# Altium schematic sheet Power managment.SchDoc
size A4; Organization: Altium Limited; Address1: L3, 12a Rodborough Rd; Address2: Frenchs Forest; Address3: NSW; Address4: Australia 2086
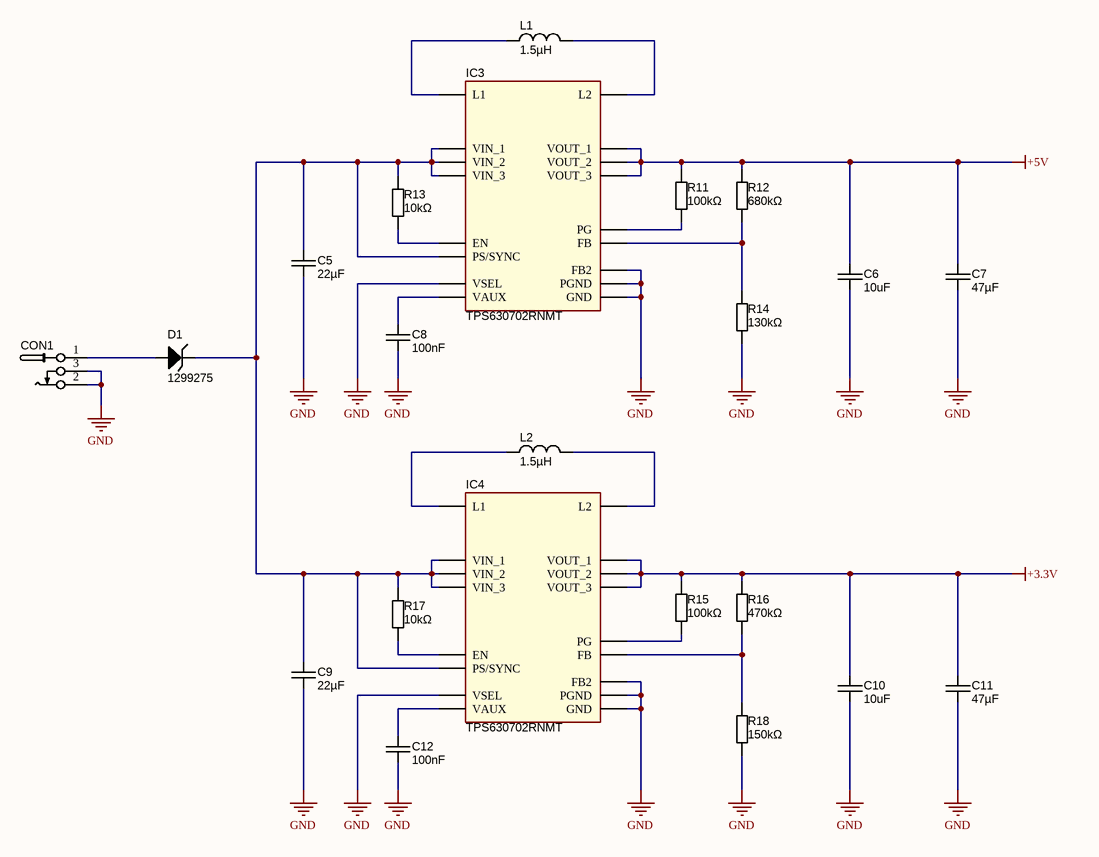
[diagram p0: Power managment.SchDoc]

## Parts
C5  value 22µF  [CAPC3216N]  (hidden comment: approved sub OK)
C6  value 10uF  [CAPC1608N]  (hidden comment: approved sub OK)
C7  value 47µF  [CAPC3216N]  (hidden comment: approved sub OK)
C8  value 100nF  [CAPC1608N]  (hidden comment: approved sub OK)
C9  value 22µF  [CAPC3216N]  (hidden comment: approved sub OK)
C10  value 10uF  [CAPC1608N]  (hidden comment: approved sub OK)
C11  value 47µF  [CAPC3216N]  (hidden comment: approved sub OK)
C12  value 100nF  [CAPC1608N]  (hidden comment: approved sub OK)
CON1  12V  [FC68148S_2]  (value not drawn)
D1  Supplier Part Number 1: 1299275  [DO-214AC_Unidirectional]  (hidden comment: Unidirectional, 400 W, 100 VDC)
IC3  TPS630702RNMT  [TPS630702RNMT]
IC4  TPS630702RNMT  [TPS630702RNMT]
L1  1.5µH  [INDPM6965X300N]
L2  1.5µH  [INDPM6965X300N]
R11  value 100kΩ  [RESC1608N]  (hidden comment: Thick Film)
R12  value 680kΩ  [RESC1608N]  (hidden comment: Thick Film)
R13  value 10kΩ  [RESC1608N]  (hidden comment: Thick Film)
R14  value 130kΩ  [RESC1608N]  (hidden comment: Thick Film)
R15  value 100kΩ  [RESC1608N]  (hidden comment: Thick Film)
R16  value 470kΩ  [RESC1608N]  (hidden comment: Thick Film)
R17  value 10kΩ  [RESC1608N]  (hidden comment: Thick Film)
R18  value 150kΩ  [RESC1608N]  (hidden comment: Thick Film)

## Nets
+3.3V: C10.2 C11.1 IC4.7(VOUT_1) IC4.8(VOUT_2) IC4.A7(VOUT_3) R15.2 R16.2
+5V: C6.2 C7.1 IC3.7(VOUT_1) IC3.8(VOUT_2) IC3.A7(VOUT_3) R11.2 R12.2
GND: C5.2 C6.1 C7.2 C8.1 C9.2 C10.1 C11.2 C12.1 CON1.2 CON1.3 IC3.4(GND) IC3.6(FB2) IC3.10(PGND) IC3.15(VSEL) IC4.4(GND) IC4.6(FB2) IC4.10(PGND) IC4.15(VSEL) R14.1 R18.1
NetC5_1: C5.1 C9.1 D1.1 IC3.1(PS/SYNC) IC3.12(VIN_1) IC3.13(VIN_2) IC3.A12(VIN_3) IC4.1(PS/SYNC) IC4.12(VIN_1) IC4.13(VIN_2) IC4.A12(VIN_3) R13.2 R17.2
NetC8_2: C8.2 IC3.3(VAUX)
NetC12_2: C12.2 IC4.3(VAUX)
NetCON1_1: CON1.1 D1.2
NetIC3_2: IC3.2(PG) R11.1
NetIC3_5: IC3.5(FB) R12.1 R14.2
NetIC3_9: IC3.9(L2) L1.2
NetIC3_11: IC3.11(L1) L1.1
NetIC3_14: IC3.14(EN) R13.1
NetIC4_2: IC4.2(PG) R15.1
NetIC4_5: IC4.5(FB) R16.1 R18.2
NetIC4_9: IC4.9(L2) L2.2
NetIC4_11: IC4.11(L1) L2.1
NetIC4_14: IC4.14(EN) R17.1

## Notes on the sheet
- Title
- Size:
- Date:
- A4
- Number:
- Time:
- Revision:
- Sheet
- of
- File:

## Library data of the parts
C5 C7 C9 C11 = CAPC_10u_1206_16V: Capacitor SMD Cer 10uF 10% 16V X7R 1206; Manufacturer 1: Kemet; Manufacturer Part Number 1: C1206C106K4RACTU; Ratings: 16V; X7R; Material: ceramic; Package / Case: 1206 (3216 metric); Tolerance: ±10%; Supplier 1: Digi-Key; Supplier Part Number 1: 399-3525-1-ND
C6 C8 C10 C12 = CAPC_1u_0603: Capacitor SMD Cer 1uF 10% 16V X7R 0603; Manufacturer 1: TDK Corporation; Manufacturer Part Number 1: C1608X7R1C105K; Ratings: 16V; X7R; Material: ceramic; Package / Case: 0603 (1608 metric); Tolerance: ±10%; Supplier 1: Digi-Key; Supplier Part Number 1: 445-1604-1-ND
CON1 = CONN_PWR_JACK_2.1x5.5mm: Power Connector, THT, 2.1mm ID, 5.5mm OD; Manufacturer 1: CUI Inc; Manufacturer Part Number 1: PJ-102AH; Category: Connectors; Mounting Type: Through Hole; Package / Case: PCB mount; Value: 2.1mm ID, 5.5mm OD; Supplier 1: Digi-Key; Supplier Part Number 1: CP-102AH-ND
D1 = WE-TVSP DO-214AC, 824500102: WE-TVSP Power TVS Diode, Unidirectional, 400 W, 100 VDC; Manufacturer: Wurth Elektronik; Manufacturer Part Number: SK24A; Repetitive Reverse Voltage Vrrm Max: 40; Forward Current If(AV): 2; Diode Configuration: Single; Diode Case Style: DO-214; Forward Voltage VF Max: 500; Forward Surge Current Ifsm Max: 50; Product Range: SK Series; SVHC: No SVHC (17-Dec-2015); Diode Type: Schottky; Junction Temperature Tj Max: 125; Junction Temperature Tj Min: -65; partNo: 824500102; ComponentLink1Description: Manufacturer; ComponentLink1URL: http://www.we-online.de; Created by: Baojun Chen; Created Date: Nov.2015; ComponentLink2Description: Datasheet; ComponentLink2URL: http://katalog.we-online.de/pbs/datasheet/824500102.pdf; Supplier 1: Farnell; RoHS: YES; Stock 1: 30726; Pricing 1: 5=0.071, 100=0.0686, 250=0.0662, 1000=0.0638, 3600=0.0614, 20000=0.059, 50000=0.057, 90000=0.055 (EUR); No. of Pins: 2; Operating Temperature Max: 125; Packaging: Cut Tape; Automotive Qualification Standard: -; Alternate Case Style: DO-214; Current Ifsm: 50; Current Ir Max: 500; Forward Voltage: 500; MSL: MSL 1 - Unlimited; Operating Temperature Min: -65; Operating Temperature Range: -65°C to +125; Reverse Voltage Vr Max: 40; Termination Type: Surface Mount Device<!--FANDB--><div class="features-and-benefits-container"><div class="features-and-benefits-description"><span class="features-benefits-value">The SK24A is a surface-mount Schottky Barrier Rectifier with moulded plastic case and solder-plated terminals.</span></div><div class="features-and-benefits-list"><ul class="features-and-benefits-list-list"><li class="features-and-benefits-list-item">Polarity is indicated by cathode band</li><li class="features-and-benefits-list-item">Metal to silicon rectifier, majority carrier conduction</li><li class="features-and-benefits-list-item">Low forward voltage drop</li><li class="features-and-benefits-list-item">Easy pick and place</li><li class="features-and-benefits-list-item">High surge current capability</li><li class="features-and-benefits-list-item">UL94V-0 Flammability rating</li><li class="features-and-benefits-list-item">Epitaxial construction</li><li class="features-and-benefits-list-item">260°C/10; ComponentLink3URL: http://www.farnell.com/datasheets/51631.pdf; ComponentLink3Description: http://www.farnell.com/datasheets/51631.pdf
IC3 IC4 = TPS630702RNMT: Integrated Circuit; Manufacturer_Name: Texas Instruments; Datasheet Link: http://www.ti.com/lit/gpn/TPS63070; Height: 1mm; Manufacturer_Part_Number: TPS630702RNMT; Mouser Part Number: 595-TPS630702RNMT; Mouser Price/Stock: https://www.mouser.co.uk/ProductDetail/Texas-Instruments/TPS630702RNMT?qs=vLWxofP3U2wR9GhA3fXurw%3D%3D; Arrow Part Number: TPS630702RNMT; Arrow Price/Stock: https://www.arrow.com/en/products/tps630702rnmt/texas-instruments
L1 L2 = INDC_1.5u: Inductor SMD Low DCR 10 µH 900mA 20% 1210; Manufacturer 1: Taiyo Yuden; Manufacturer Part Number 1: CBC3225T100MR; Ratings: 900 mA; 133 mOhm; DC Resistance (DCR): 172.9 mOhm Max; Frequency - Self Resonant: 23MHz; Frequency - Test: 100kHz; Tolerance: ±20%; Supplier 1: Digi-Key; Supplier Part Number 1: 587-1625-1-ND; Current: 900mA; Current - Saturation: 900mA; Current - Temperature Rise: 900mA; Applications: Power Supplies; Package / Case: 1210 (3225 Metric); Operating Temperature: -40°C ~ 105°C; ComponentLink1URL: http://www.yuden.co.jp/ut/product/pdf/wound02_e.pdf; ComponentLink1Description: http://www.yuden.co.jp/ut/product/pdf/wound02_e.pdf; Value: 1.5µH
R11-R18 = RES_1K5_0603_5%: Resistor SMD chip 1.5k Ohm 0.1W 5% 0603; Manufacturer 1: Yageo; Manufacturer Part Number 1: RC0603JR-071K5L; Ratings: 1/10 W; Package / Case: 0603 (1608 metric); Tolerance: ±5%; Material: thick film; Supplier 1: Digi-Key; Supplier Part Number 1: 311-1.5KGRCT-ND